# EAGLE schematic PIRSN v1 (EAGLE 9.6.2)
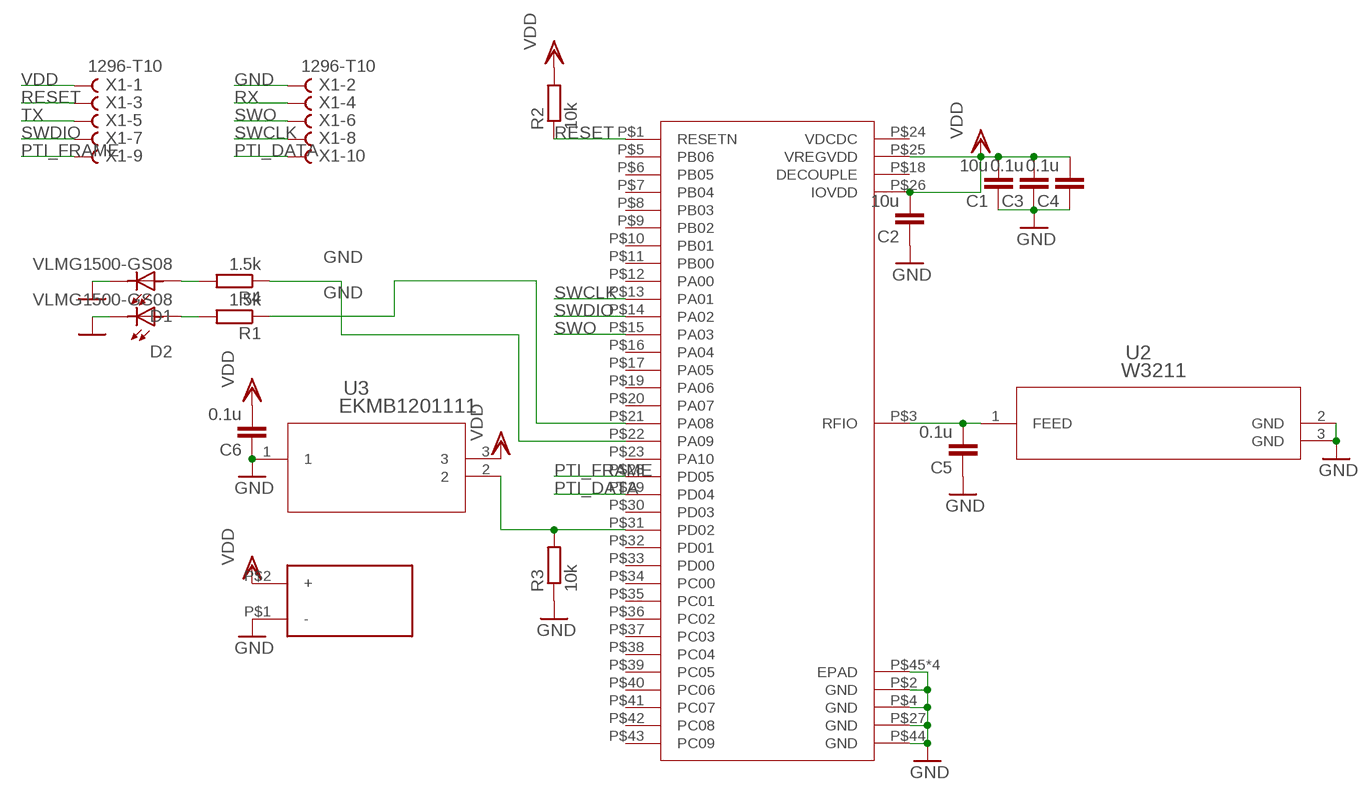
[diagram p0: schematic, sheet 1]

## Parts
C1  10u  CC0603R  [C0603R]
C2  10u  CC0603R  [C0603R]
C3  0.1u  CC0402  [C0402]
C4  0.1u  CC0402  [C0402]
C5  0.1u  CC0402  [C0402]
C6  0.1u  CC0402  [C0402]
D1  VLMG1500-GS08  [LEDC1005X35N]
D2  VLMG1500-GS08  [LEDC1005X35N]
R1  1.5k  RR0402  [R0402]
R2  10k  RR0402  [R0402]
R3  10k  RR0402  [R0402]
R4  1.5k  RR0402  [R0402]
U2  W3211  [CHIP_3211_PUL]
U3  EKMB1201111  [SENSOR_B1201111_PAN]
U$1  ZGM230S  [ZGM230S]
U$2  BS-24R  [BS-24]
X1  1296-T10  [1296-10]

## Nets
GND: C1.1 C2.1 C3.1 C4.1 C5.1 C6.1 D1.2 D2.2 R3.1 U2.2(GND) U2.3(GND) U3.1 U$1.P$2(GND) U$1.P$4(GND) U$1.P$27(GND) U$1.P$44(GND) U$1.P$45(EPAD) U$1.P$46(EPAD) U$1.P$47(EPAD) U$1.P$48(EPAD) U$2.P$1(-) X1.2
N$1: D2.1 R1.2
N$2: R1.1 U$1.P$21(PA08)
N$3: R4.1 U$1.P$22(PA09)
N$4: R3.2 U3.2 U$1.P$31(PD02)
N$5: C5.2 U2.1(FEED) U$1.P$3(RFIO)
N$7: D1.1 R4.2
PTI_DATA: U$1.P$29(PD04) X1.10
PTI_FRAME: U$1.P$28(PD05) X1.9
RESET: R2.1 U$1.P$1(RESETN) X1.3
RX: X1.4
SWCLK: U$1.P$13(PA01) X1.8
SWDIO: U$1.P$14(PA02) X1.7
SWO: U$1.P$15(PA03) X1.6
TX: X1.5
VDD: C1.2 C2.2 C3.2 C4.2 C6.2 R2.2 U3.3 U$1.P$25(VREGVDD) U$1.P$26(IOVDD) U$2.P$2(+) X1.1
Unconnected: U$1.P$5(PB06) U$1.P$6(PB05) U$1.P$7(PB04) U$1.P$8(PB03) U$1.P$9(PB02) U$1.P$10(PB01) U$1.P$11(PB00) U$1.P$12(PA00) U$1.P$16(PA04) U$1.P$17(PA05) U$1.P$18(DECOUPLE) U$1.P$19(PA06) U$1.P$20(PA07) U$1.P$23(PA10) U$1.P$24(VDCDC) U$1.P$30(PD03) U$1.P$32(PD01) U$1.P$33(PD00) U$1.P$34(PC00) U$1.P$35(PC01) U$1.P$36(PC02) U$1.P$37(PC03) U$1.P$38(PC04) U$1.P$39(PC05) U$1.P$40(PC06) U$1.P$41(PC07) U$1.P$42(PC08) U$1.P$43(PC09)

## Library data of the parts
C1 C2 = eagle-ltspice:C: CAPACITOR, European symbol
C3-C6 = eagle-ltspice:C: CAPACITOR, European symbol; SPICEMODEL: NONE; SPICEPREFIX: C
D1 D2 = VLMG1500-GS08:VLMG1500-GS08: 0402 GREEN 571nm 35MCD 65° Rectangle with Flat Top SMT LED; AVAILABILITY: Unavailable; DESCRIPTION: 0402 GREEN 571nm 35MCD 65° Rectangle with Flat Top SMT LED; MF: Vishay; MP: VLMG1500-GS08; PACKAGE: 0402 Vishay; PRICE: None
R1-R4 = eagle-ltspice:R: RESISTOR, European symbol; SPICEMODEL: NONE; SPICEPREFIX: R
U2 = W3211:W3211; COPYRIGHT: Copyright (C) 2022 Ultra Librarian. All rights reserved.; MANUFACTURER_PART_NUMBER: W3211; MFR_NAME: Pulse Electronics Corporation
U3 = EKMB1110112:EKMB1201111; COPYRIGHT: Copyright (C) 2022 Ultra Librarian. All rights reserved.; MANUFACTURER_PART_NUMBER: EKMB1201111; MFR_NAME: Panasonic
U$1 = ZGM230S:ZGM230S
U$2 = BS-24:BS-24R
X1 = con-leotronics:1296-T10: 1.27mm SINGLE ROW FEMALE SOCKET Source: http://www.leotronics.co.uk/Conexcon/Data%20Sheets/sec.%20A/1296ing.pdf; OC_FARNELL: unknown; OC_NEWARK: unknown